# EAGLE design module (EAGLE 9.6.2)
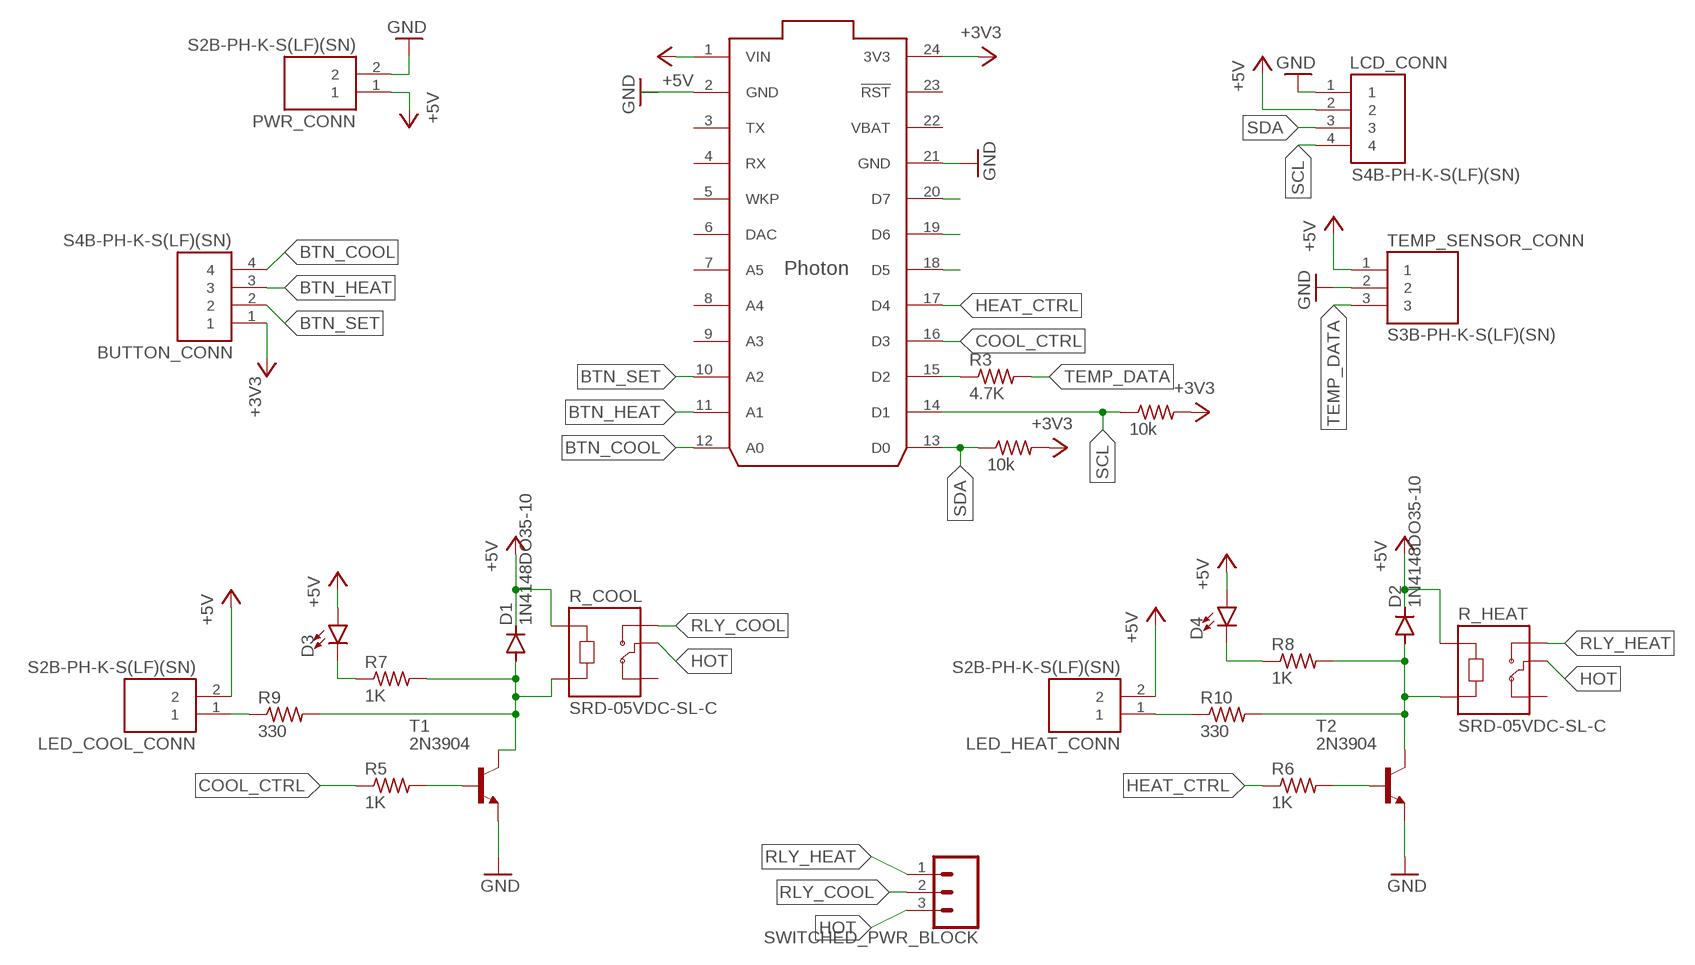
[diagram p0: schematic, sheet 1]

## Parts
BUTTON_CONN  S4B-PH-K-S(LF)(SN)  [JST_S4B-PH-K-S(LF)(SN)]
D1  1N4148DO35-10  [DO35-10]
D2  1N4148DO35-10  [DO35-10]
D3  LED5MM  [LED_5MM]
D4  LED5MM  [LED_5MM]
LCD_CONN  S4B-PH-K-S(LF)(SN)  [JST_S4B-PH-K-S(LF)(SN)]
LED_COOL_CONN  S2B-PH-K-S(LF)(SN)  [JST_S2B-PH-K-S(LF)(SN)]
LED_HEAT_CONN  S2B-PH-K-S(LF)(SN)  [JST_S2B-PH-K-S(LF)(SN)]
PWR_CONN  S2B-PH-K-S(LF)(SN)  [JST_S2B-PH-K-S(LF)(SN)]
R1  10k  R-US_0207/10  [0207/10]
R2  10k  R-US_0207/10  [0207/10]
R3  4.7K  R-US_0207/10  [0207/10]
R5  1K  R-US_0207/10  [0207/10]
R6  1K  R-US_0207/10  [0207/10]
R7  1K  R-US_0207/10  [0207/10]
R8  1K  R-US_0207/10  [0207/10]
R9  330  R-US_0207/10  [0207/10]
R10  330  R-US_0207/10  [0207/10]
R_COOL  SRD-05VDC-SL-C  [RELAY_SRD-05VDC-SL-C]
R_HEAT  SRD-05VDC-SL-C  [RELAY_SRD-05VDC-SL-C]
SWITCHED_PWR_BLOCK  CONN_03-SCREW-5MM  [SCREWTERMINAL-5MM-3]
T1  2N3904  [TO92]
T2  2N3904  [TO92]
TEMP_SENSOR_CONN  S3B-PH-K-S(LF)(SN)  [JST_S3B-PH-K-S(LF)(SN)]
U$1  PHOTON_WITH_HEADERS  [PHOTON]

## Nets
+3V3: BUTTON_CONN.1 R1.2 R2.2 U$1.24(3V3)
+5V: D1.C D2.C D3.A D4.A LCD_CONN.2 LED_COOL_CONN.2 LED_HEAT_CONN.2 PWR_CONN.1 R_COOL.A1 R_HEAT.A1 TEMP_SENSOR_CONN.1 U$1.1(VIN)
BTN_COOL: BUTTON_CONN.4 U$1.12(A0)
BTN_DOWN: U$1.18(D5)
BTN_HEAT: BUTTON_CONN.3 U$1.11(A1)
BTN_SET: BUTTON_CONN.2 U$1.10(A2) U$1.20(D7)
BTN_UP: U$1.19(D6)
COOL_CTRL: R5.1 U$1.16(D3)
GND: LCD_CONN.1 PWR_CONN.2 T1.3(E) T2.3(E) TEMP_SENSOR_CONN.2 U$1.2(GND) U$1.21(GND)
HEAT_CTRL: R6.1 U$1.17(D4)
HOT [high_pwr]: R_COOL.COM R_HEAT.COM SWITCHED_PWR_BLOCK.3
N$1: R3.1 U$1.15(D2)
N$2: LED_COOL_CONN.1 R9.1
N$3: LED_HEAT_CONN.1 R10.1
N$4: D1.A R7.2 R9.2 R_COOL.A2 T1.1(C)
N$5: D3.K(C) R7.1
N$6: R5.2 T1.2(B)
N$8: R6.2 T2.2(B)
N$9: D2.A R8.2 R10.2 R_HEAT.A2 T2.1(C)
N$13: D4.K(C) R8.1
RLY_COOL [high_pwr]: R_COOL.NO SWITCHED_PWR_BLOCK.2
RLY_HEAT [high_pwr]: R_HEAT.NO SWITCHED_PWR_BLOCK.1
SCL: LCD_CONN.4 R1.1 U$1.14(D1)
SDA: LCD_CONN.3 R2.1 U$1.13(D0)
TEMP_DATA: R3.2 TEMP_SENSOR_CONN.3
Unconnected: R_COOL.NC R_HEAT.NC U$1.3(TX) U$1.4(RX) U$1.5(WKP) U$1.6(DAC) U$1.7(A5) U$1.8(A4) U$1.9(A3) U$1.23(!RST)

## Power pins joined to a net without a drawn wire
VBAT: U$1.22(VBAT)

## Library data of the parts
BUTTON_CONN LCD_CONN = S4B-PH-K-S_LF__SN_:S4B-PH-K-S(LF)(SN): PH Series 4 Position 2 mm Pitch Through Hole Side Entry Shrouded Header Check availability <https://pricing.snapeda.com/parts/S4B-PH-K-S%28LF%29%28SN%29/JST%20Sales/view-part?ref=eda>; AVAILABILITY: In Stock; DESCRIPTION: Connector Header Through Hole, Right Angle 4 position 0.079 (2.00mm); MF: JST Sales; MP: S4B-PH-K-S(LF)(SN); PACKAGE: None; PRICE: None
D1 D2 = diode:1N4148: DIODE high speed (Philips)
D3 D4 = SparkFun-LED:LED: LED (Generic) Standard schematic elements and footprints for 5mm, 3mm, 1206, and 0603 sized LEDs. Generic LEDs with no color specified.
LED_COOL_CONN LED_HEAT_CONN PWR_CONN = S2B-PH-K-S_LF__SN_:S2B-PH-K-S(LF)(SN): PH Series 2 Position 2.0 mm Through Hole Side Entry Shrouded Header Check availability <https://pricing.snapeda.com/parts/S2B-PH-K-S%28LF%29%28SN%29/JST%20Sales%20America%20Inc./view-part?ref=eda>; AVAILABILITY: In Stock; DESCRIPTION: Connector Header Through Hole, Right Angle 2 position; MF: JST Sales America Inc.; MP: S2B-PH-K-S(LF)(SN); PACKAGE: None; PRICE: None
R1-R3 R5-R10 = rcl:R-US_: RESISTOR, American symbol; SPICEPREFIX: R
R_COOL R_HEAT = SRD-05VDC-SL-C:SRD-05VDC-SL-C: 5V Trigger Relay Module For Arduino And Raspberry Pi 5V Trigger Relay Module For Arduino And Raspberry Pi Check availability <https://pricing.snapeda.com/parts/SRD-05VDC-SL-C/Songle%20Relay/view-part?ref=eda>; AVAILABILITY: Not in stock; DESCRIPTION: 5V Trigger Relay Module For Arduino And Raspberry Pi 5V Trigger Relay Module For Arduino And Raspberry Pi; MF: Songle Relay; MP: SRD-05VDC-SL-C; PACKAGE: None; PRICE: None
SWITCHED_PWR_BLOCK = SparkFun-Connectors:CONN_03: Multi connection point. Often used as Generic Header-pin footprint for 0.1 inch spaced/style header connections On any of the 0.1 inch spaced packages, you can populate with these: Break Away Headers - Straight <https://www.sparkfun.com/products/116> (PRT-00116) Break Away Male Headers - Right Angle <https://www.sparkfun.com/products/553> (PRT-00553) Female Headers <https://www.sparkfun.com/products/115> (PRT-00115) Break Away Headers - Machine Pin <https://www.sparkfun.com/products/117> (PRT-00117) Break Away Female Headers - Swiss Machine Pin <https://www.sparkfun.com/products/743> (PRT-00743) Stackable Header - 3 Pin (Female, 0.1") <https://www.sparkfun.com/products/13875> (PRT-13875) For SCREWTERMINALS and SPRING TERMINALS visit here: Screw Terimnals on SparkFun.com <https://www.sparkfun.com/search/results?term=Screw+Terminals> (5mm/3.5mm/2.54mm spacing) This device is also useful as a general connection point to wire up your design to another part of your project. Our various solder wires solder well into these plated through hole pads. Hook-Up Wire - Assortment (Stranded, 22 AWG) <https://www.sparkfun.com/products/11375> (PRT-11375) Hook-Up Wire - Assortment (Solid Core, 22 AWG) <https://www.sparkfun.com/products/11367> (PRT-11367) View the entire wire category on our website here <https://www.sparkfun.com/categories/141> Special notes: Molex polarized connector foot print use with SKU : PRT-08232 with associated crimp pins and housings.; PROD_ID: CONN-10134; SF_SKU: PRT-08433
T1 T2 = transistor:2N3904: NPN TRANSISTOR
TEMP_SENSOR_CONN = S3B-PH-K-S_LF__SN_:S3B-PH-K-S(LF)(SN): Connector Header Through Hole, Right Angle 3 position 0.079" (2.00mm); DESCRIPTION: Connector Header Through Hole, Right Angle 3 position 0.079 (2.00mm); DIGI-KEY_PART_NUMBER: 455-1720-ND; MF: JST Sales; MP: S3B-PH-K-S(LF)(SN); PACKAGE: None
U$1 = Particle-Devices:PHOTON: Particle Photon Wi-Fi through-hole development board footprint Product datasheet: here <https://docs.particle.io/datasheets/photon-(wifi)/photon-datasheet/> Design files: here <https://github.com/particle-iot/photon> Github : Particle devices library <https://github.com/particle-iot/hardware-libraries/tree/master/Eagle>

## Net classes
0 default: width 0.305 mm, drill 0.61 mm, clearance 0.254 mm
1 high_pwr: width 2.54 mm, drill 1.27 mm, clearance 1.016 mm

## Board
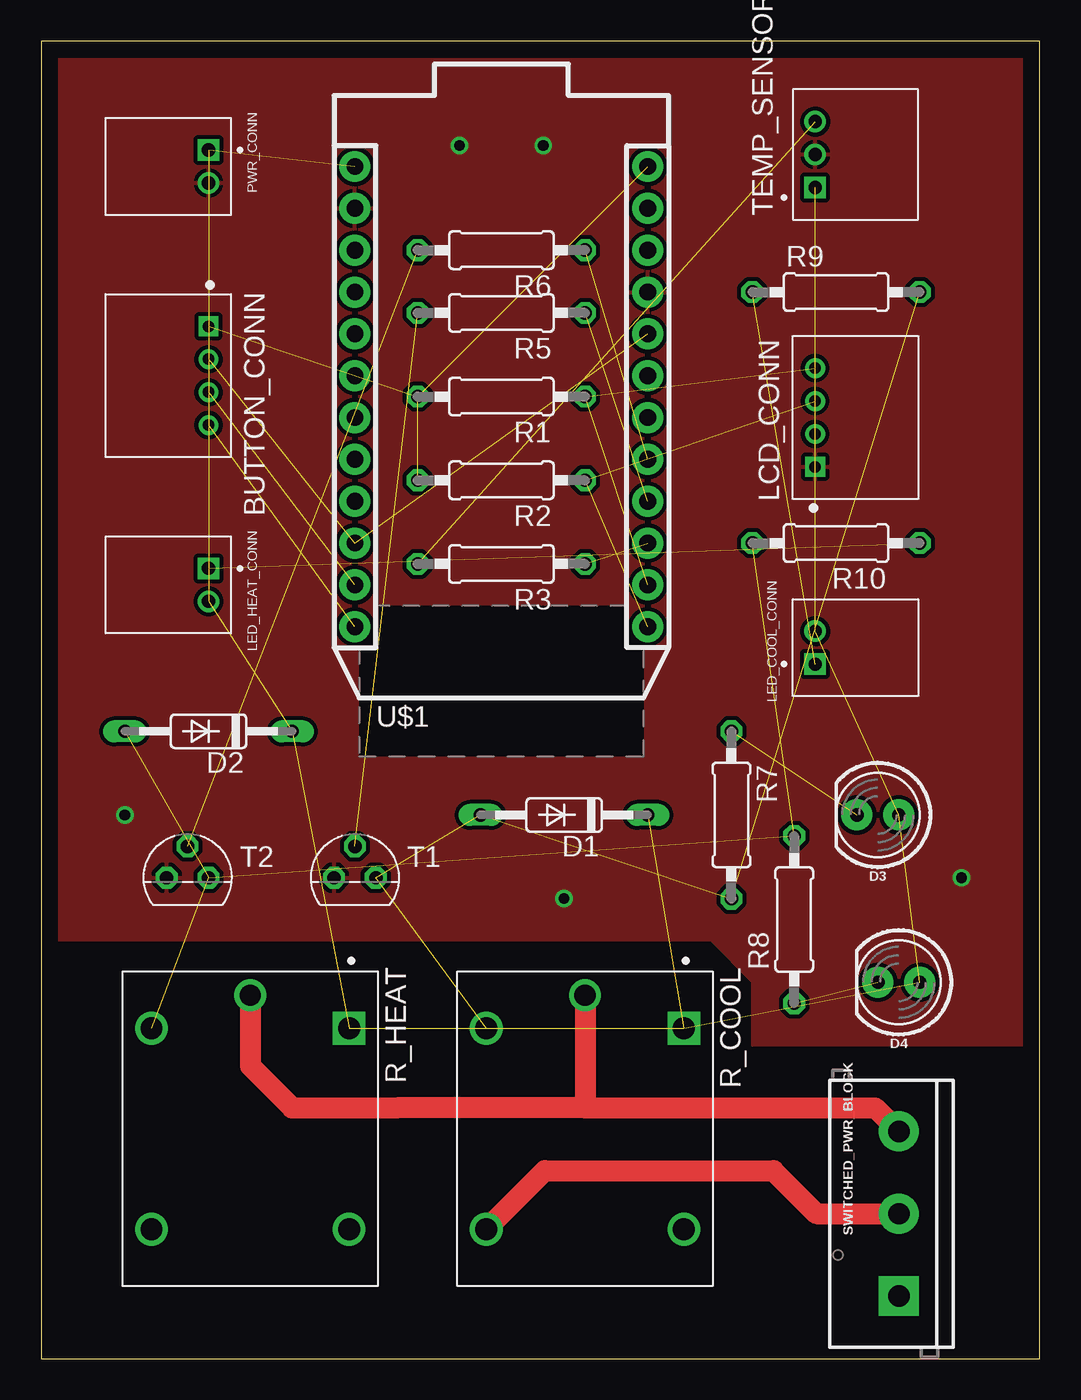
[diagram p1: board, top side]
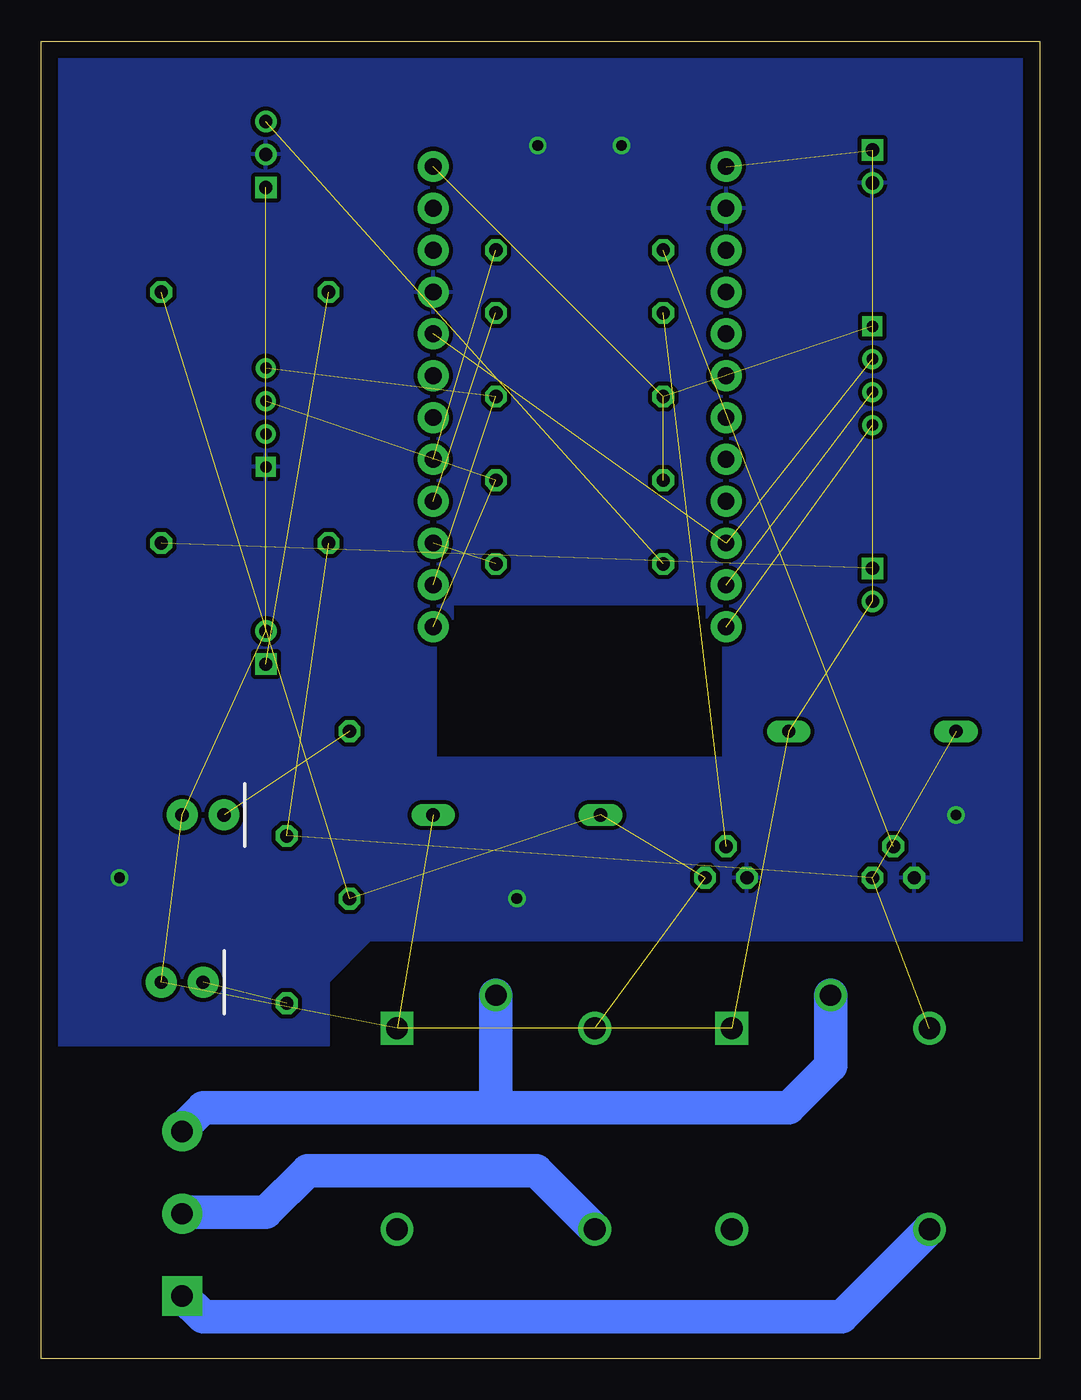
[diagram p2: board, bottom side, seen from below]

Size 60.63 x 80 mm. Coordinates in mm from the lower left corner, seen from the top.
Outline: 0,0 60.63,0 60.63,80 0,80 0,0
Copper layers (1*16): Top 0.035mm / dielectric 1.5mm / Bottom 0.035mm
Design rules "default": minimum track width 6mil, minimum drill 0.35mm, track to track 6mil, track to pad 6mil, pad to pad 6mil, via to via 6mil, smd to smd 6mil, copper to edge 40mil, drill to drill 6mil, minimum pad ring 10mil, minimum via ring 8mil, stop-mask expansion 4mil, vias tented up to drill 0mil, thermal gap 10mil

### Footprints (pad centres in the part's own frame; a part is rotated, then mirrored left to right if it is on the bottom)
JST_S4B-PH-K-S(LF)(SN) = drill 0.7 square: 1 -3,0 | drill 0.7: 2 -1,0; 3 1,0; 4 3,0
DO35-10 = drill 0.813 long: A 5.08,0; C -5.08,0
LED_5MM = drill 0.813 pad 1.88: A -1.27,0; K 1.27,0
JST_S2B-PH-K-S(LF)(SN) = drill 0.8 square: 1 -1,0 | drill 0.8: 2 1,0
0207/10 = drill 0.813 octagon: 1 -5.08,0; 2 5.08,0
RELAY_SRD-05VDC-SL-C = drill 1.32 square: A1 -6.1,6 | drill 1.32: A2 -6.1,-6; NC 6.1,6; NO 6.1,-6 | drill 1.29: COM -8.1,0
SCREWTERMINAL-5MM-3 = drill 1.3 pad 2.413 square: 1 0,0 | drill 1.3 pad 2.413: 2 5,0; 3 10,0
TO92 = drill 0.813 octagon: 1 1.27,0; 2 0,1.905; 3 -1.27,0
JST_S3B-PH-K-S(LF)(SN) = drill 0.8 square: 1 0,0 | drill 0.8: 2 2,0; 3 4,0
PHOTON = drill 1.016 pad 1.88: 1 1.27,33.02; 2 1.27,30.48; 3 1.27,27.94; 4 1.27,25.4; 5 1.27,22.86; 6 1.27,20.32; 7 1.27,17.78; 8 1.27,15.24; 9 1.27,12.7; 10 1.27,10.16; 11 1.27,7.62; 12 1.27,5.08; 13 19.05,5.08; 14 19.05,7.62; 15 19.05,10.16; 16 19.05,12.7; 17 19.05,15.24; 18 19.05,17.78; 19 19.05,20.32; 20 19.05,22.86; 21 19.05,25.4; 22 19.05,27.94; 23 19.05,30.48; 24 19.05,33.02

### Placement (x,y rotation side)
BUTTON_CONN  10.16,59.69 270 top
D1  31.75,33.02 180 top
D2  10.16,38.1 180 top
D3  50.8,33.02 180 top
D4  52.07,22.86 180 top
LCD_CONN  46.99,57.15 90 top
LED_COOL_CONN  46.99,43.18 90 top
LED_HEAT_CONN  10.16,46.99 270 top
PWR_CONN  10.16,72.39 270 top
R1  27.94,58.42 180 top
R2  27.94,53.34 180 top
R3  27.94,48.26 180 top
R5  27.94,63.5 180 top
R6  27.94,67.31 180 top
R7  41.91,33.02 270 top
R8  45.72,26.67 90 top
R9  48.26,64.77 0 top
R10  48.26,49.53 180 top
R_COOL  33.02,13.97 270 top
R_HEAT  12.7,13.97 270 top
SWITCHED_PWR_BLOCK  52.07,3.81 90 top
T1  19.05,29.21 0 top
T2  8.89,29.21 0 top
TEMP_SENSOR_CONN  46.99,71.12 90 top
U$1  17.78,39.37 0 top

### Tracks (layer width: path | path; a pad name or v marks a point on that pad's centre or on a via)
+3V3  (3 unrouted)
+5V  (11 unrouted)
BTN_COOL  (1 unrouted)
BTN_HEAT  (1 unrouted)
BTN_SET  (2 unrouted)
COOL_CTRL  (1 unrouted)
GND  (via drill 0.65)
  other vias: 25.4,73.66 30.48,73.66 31.75,27.94 5.08,33.02 55.88,29.21
  pour Top: -1.27,81.28 -1.27,26.67 0,25.4 40.64,25.4 43.18,22.86 43.18,19.05 62.23,19.05 62.23,81.28
  pour Bottom: -1.27,80.01 -1.27,25.4 40.64,25.4 43.18,22.86 43.18,19.05 62.23,19.05 62.23,81.28 -1.27,81.28
HEAT_CTRL  (1 unrouted)
HOT
  Top 1.27: R_HEAT.COM 12.7,17.78 15.24,15.24 21.59,15.24 33.02,15.24 | SWITCHED_PWR_BLOCK.3 50.64,15.24 33.02,15.24 | R_COOL.COM 33.02,15.24
  Bottom 1.27: 52.07,13.97 SWITCHED_PWR_BLOCK.3
  Bottom 2.032: R_HEAT.COM 12.7,17.78 15.24,15.24 33.02,15.24 | 33.02,15.24 50.8,15.24 52.07,13.97 | R_COOL.COM 33.02,15.24
N$1  (1 unrouted)
N$2  (1 unrouted)
N$3  (1 unrouted)
N$4  (4 unrouted)
N$5  (1 unrouted)
N$6  (1 unrouted)
N$8  (1 unrouted)
N$9  (4 unrouted)
N$13  (1 unrouted)
RLY_COOL
  Top 1.27: R_COOL.NO 30.58,11.43 44.45,11.43 47.07,8.81 SWITCHED_PWR_BLOCK.2
  Bottom 2.032: R_COOL.NO 30.58,11.43 44.45,11.43 46.99,8.89 52.07,8.89
RLY_HEAT
  Bottom 2.032: R_HEAT.NO 12.03,2.54 50.8,2.54 SWITCHED_PWR_BLOCK.1
SCL  (2 unrouted)
SDA  (2 unrouted)
TEMP_DATA  (1 unrouted)